# EasyEDA Pro project New Project_2026-09-05_09-11-29.eprj, schematic Schematic2
Board Name: 灯珠板; Create Date: 2026-09-05; Page Name: P1; Project Name: New Project_2026-09-05_09-11-29; Schematic Name: Schematic2; Update Date: 2026-09-06; Company: 嘉立创EDA; Page Size: A4; Version: V1.0
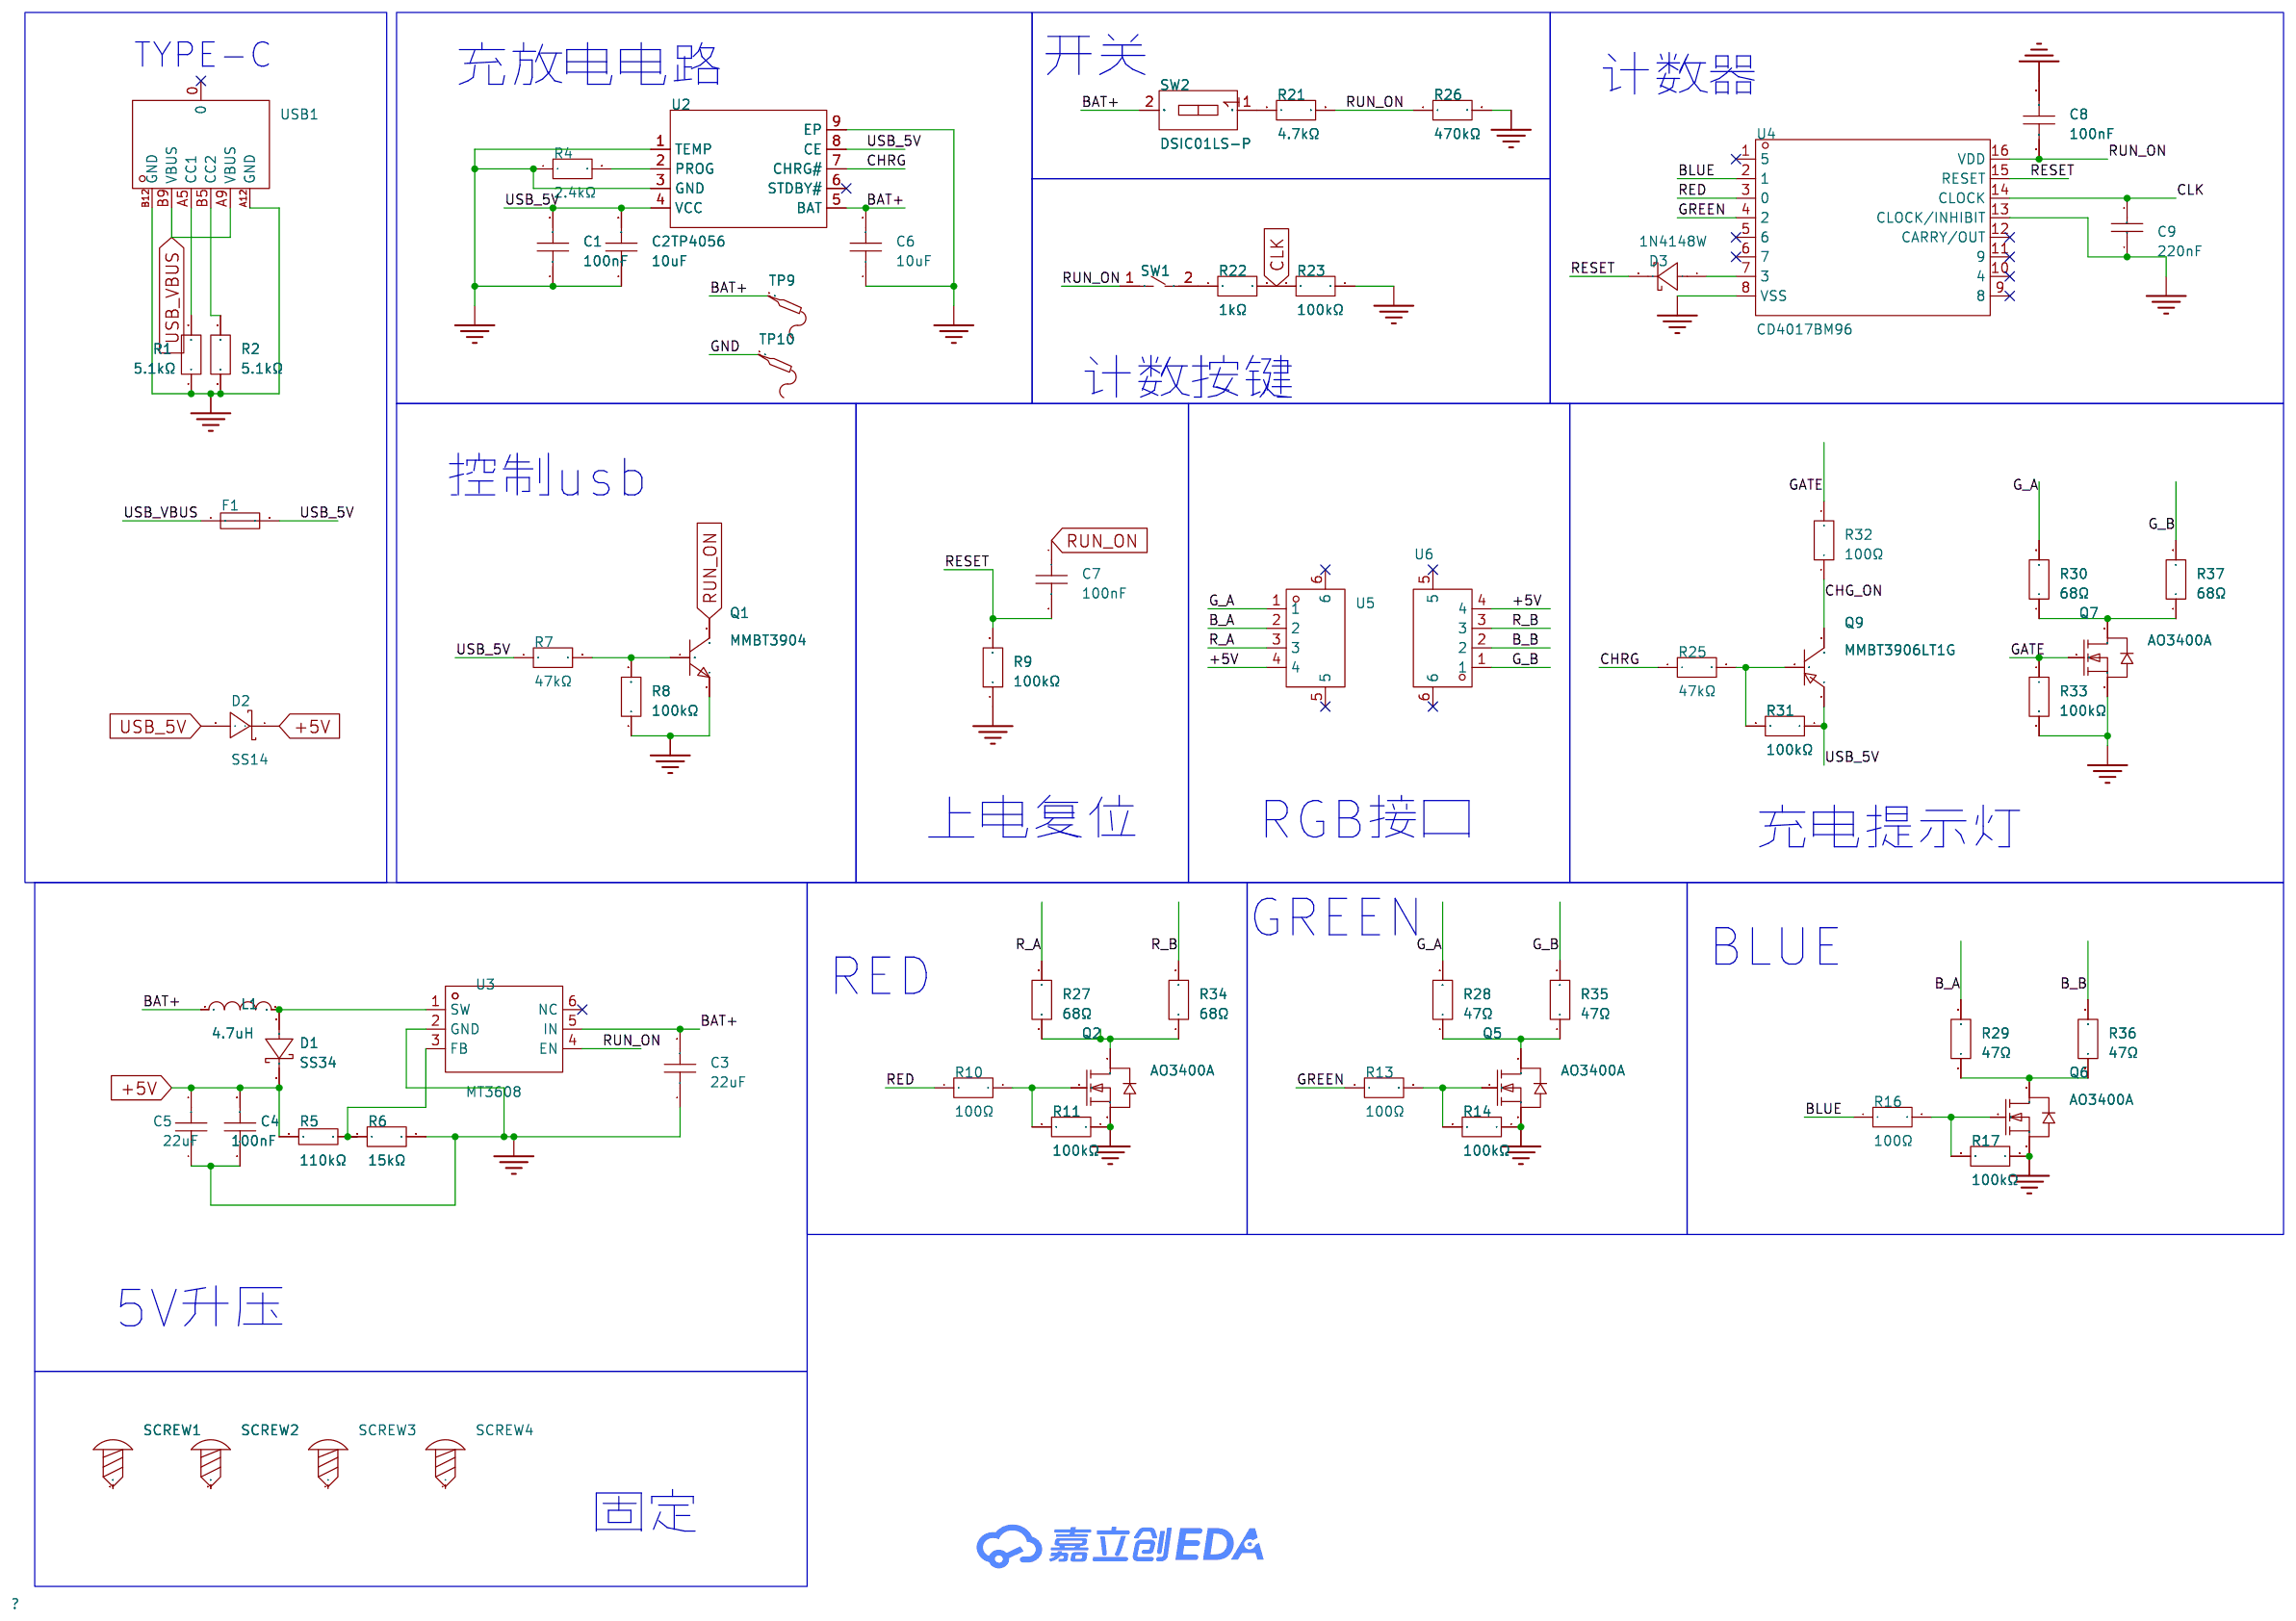
[diagram p0: schematic sheet]

## Parts
C1  100nF  [C0603]
C2  10uF  [C1206]
C3  22uF  [C0805]
C4  100nF  [C0603]
C5  22uF  [C0805]
C6  10uF  [C1206]
C7  100nF  [C0603]
C8  100nF  [C0603]
C9  220nF  [C0603]
D1  SS34  [SMA_L4.3-W2.6-LS5.0-FD]
D2  SS14  [SMA_L4.3-W2.6-LS5.2-RD]
D3  1N4148W  [SOD-123_L2.7-W1.6-LS3.7-FD]
F1  BSMD1206-200-6V  [F1206]
L1  4.7uH  [IND-SMD_L4.6-W4.1-A]
Q1  MMBT3904  [SOT-23-3_L2.9-W1.3-P1.90-LS2.4-BR]
Q2  AO3400A  [SOT-23-3_L2.9-W1.3-P1.90-LS2.4-BR]
Q5  AO3400A  [SOT-23-3_L2.9-W1.3-P1.90-LS2.4-BR]
Q6  AO3400A  [SOT-23-3_L2.9-W1.3-P1.90-LS2.4-BR]
Q7  AO3400A  [SOT-23-3_L2.9-W1.3-P1.90-LS2.4-BR]
Q9  MMBT3906LT1G  [SOT-23-3_L2.9-W1.3-P1.90-LS2.4-BR]
R1  5.1kΩ  [R0603]
R2  5.1kΩ  [R0603]
R4  2.4kΩ  [R0603]
R5  110kΩ  [R0603]
R6  15kΩ  [R0603]
R7  47kΩ  [R0603]
R8  100kΩ  [R0603]
R9  100kΩ  [R0603]
R10  100Ω  [R0603]
R11  100kΩ  [R0603]
R13  100Ω  [R0603]
R14  100kΩ  [R0603]
R16  100Ω  [R0603]
R17  100kΩ  [R0603]
R21  4.7kΩ  [R0603]
R22  1kΩ  [R0603]
R23  100kΩ  [R0603]
R25  47kΩ  [R0603]
R26  470kΩ  [R0603]
R27  68Ω  [R1210]
R28  47Ω  [R1210]
R29  47Ω  [R1210]
R30  68Ω  [R1210]
R31  100kΩ  [R0603]
R32  100Ω  [R0603]
R33  100kΩ  [R0603]
R34  68Ω  [R1210]
R35  47Ω  [R1210]
R36  47Ω  [R1210]
R37  68Ω  [R1210]
SCREW1  -  [M2螺丝]
SCREW2  -  [M2螺丝]
SCREW3  -  [M2螺丝]
SCREW4  -  [M2螺丝]
SW1  TSX06121-095B333DA-L2000  [SW-TH_L6.1-W6.1-P5.00]
SW2  DSIC01LS-P  [SW-SMD_2P-L3.5-W6.1-P2.54-LS9.8]
TP9  -  [Test-Point-0.5mm]
TP10  -  [Test-Point-0.5mm]
U2  TP4056  [ESOP-8_L4.9-W3.9-P1.27-LS6.0-BL-EP]
U3  MT3608  [SOT-23-6_L2.9-W1.6-P0.95-LS2.8-BL]
U4  CD4017BM96  [SOIC-16_L9.9-W3.9-P1.27-LS6.0-BL]
U5  WAFER-GH1.25-4PWB  [CONN-SMD_4P-P1.25_XUNPU_WAFER-GH1.25-4PWB]
U6  WAFER-GH1.25-4PWB  [CONN-SMD_4P-P1.25_XUNPU_WAFER-GH1.25-4PWB]
USB1  USB-TYPE-C-015  [USB-C-SMD_TYPE-C--015]

## Library data of the parts
C1 C4 C7 C8 = FCC0603B104K500CT: LCSC Part Name: 100nF ±10% 50V; Supplier Part: C5137636; Manufacturer: FOJAN(富捷); Supplier Footprint: 0603; JLCPCB Part Class: 扩展库; Datasheet: https://item.szlcsc.com/datasheet/FCC0603B104K500CT/5747088.html; Supplier: LCSC; Tolerance: ±10%; Voltage Rating: 50V; Temperature Coefficient: X7R; Operating Temperature: -55℃~+125℃
C2 C6 = HGC1206R5106K500NSPJ: LCSC Part Name: 10uF ±10% 50V; Supplier Part: C7432781; Manufacturer: Chinocera(华瓷); Supplier Footprint: 1206; JLCPCB Part Class: 扩展库; Datasheet: https://item.szlcsc.com/datasheet/HGC1206R5106K500NSPJ/8438263.html; Supplier: LCSC; Tolerance: ±10%; Voltage Rating: 50V; Temperature Coefficient: X5R
C3 C5 = CGA0805X5R226M250MT: LCSC Part Name: 22uF ±20% 25V; Supplier Part: C6119899; Manufacturer: HRE(芯声); Supplier Footprint: 0805; JLCPCB Part Class: 扩展库; Datasheet: https://item.szlcsc.com/datasheet/CGA0805X5R226M250MT/7062605.html; Supplier: LCSC; Tolerance: ±20%; Voltage Rating: 25V; Temperature Coefficient: X5R
C9 = CC0603KRX7R9BB224: LCSC Part Name: 220nF ±10% 50V; Supplier Part: C107083; Manufacturer: YAGEO(国巨); Supplier Footprint: 0603; JLCPCB Part Class: 扩展库; Datasheet: https://item.szlcsc.com/datasheet/CC0603KRX7R9BB224/108299.html; Supplier: LCSC; Tolerance: ±10%; Voltage Rating: 50V; Temperature Coefficient: X7R
D1 = SS34_C7420365: LCSC Part Name: 电压:40V 电流:3A; Supplier Part: C7420365; Manufacturer: R+O(宏嘉诚); Supplier Footprint: SMA(DO-214AC); JLCPCB Part Class: 扩展库; Datasheet: https://item.szlcsc.com/datasheet/SS34/8397187.html; Supplier: LCSC; Diode Configuration: 独立式; Voltage - Forward(Vf@If): 550mV@3A; Voltage - DC Reverse(Vr): 40V; Current - Rectified: 3A; Reverse Leakage Current (Ir): 200uA@40V
D2 = SS14_C83852: LCSC Part Name: 电压:40V 电流:1A; Supplier Part: C83852; Manufacturer: onsemi(安森美); Supplier Footprint: SMA(DO-214AC); JLCPCB Part Class: 扩展库; Datasheet: https://item.szlcsc.com/datasheet/SS14/85019.html; Supplier: LCSC; Voltage - Forward(Vf@If): 500mV@1A; Voltage - DC Reverse(Vr): 40V; Current - Rectified: 1A; Reverse Leakage Current (Ir): 200uA@40V; Operating Junction Temperature Range: -65℃~+125℃; Non-Repetitive Peak Forward Surge Current: 40A
D3 = 1N4148W_C7420318: LCSC Part Name: 100V 150mA; Supplier Part: C7420318; Manufacturer: R+O(宏嘉诚); Supplier Footprint: SOD-123; JLCPCB Part Class: 扩展库; Datasheet: https://item.szlcsc.com/datasheet/1N4148W/8397140.html; Supplier: LCSC; Diode Configuration: 独立式; Pd - Power Dissipation: 400mW; Current - Rectified: 150mA; Voltage - DC Reverse(Vr): 100V; Voltage - Forward(Vf@If): 1.25V@150mA; Non-Repetitive Peak Forward Surge Current: 2A; Reverse Leakage Current (Ir): 1uA@75V; Reverse Recovery Time (trr): 4ns; Operating Junction Temperature Range: -55℃~+150℃
F1 = BSMD1206-200-6V: LCSC Part Name: 6V 2A 1206自恢复; Supplier Part: C883134; Manufacturer: BHFUSE(佰宏); Supplier Footprint: 1206; JLCPCB Part Class: 扩展库; Datasheet: https://item.szlcsc.com/datasheet/BSMD1206-200-6V/947809.html; Supplier: LCSC; Voltage - Max: 6V; Current - Max: 100A; Hold Current: 2A; Trip Current: 3.5A; Power Dissipation: 1W; Resistance - Initial (Ri) (Min): 15mΩ; Resistance - Post Trip (R1) (Max): 80mΩ; Time to Trip(Max): 1.5s; Operating Temperature: -40℃~+85℃; Length: 3.6mm; Width: 1.9mm; Height: 1.6mm
L1 = SRG0420-4R7-M: LCSC Part Name: 高电流功率电感器，无卤素，金属粉末磁芯，磁屏蔽低电磁干扰，高载流低磁芯损耗，符合RoHS标准; Supplier Part: C53462918; Manufacturer: JIERR(捷而瑞); Supplier Footprint: SMD,4.6x4.1mm; JLCPCB Part Class: 扩展库; Datasheet: https://item.szlcsc.com/datasheet/SRG0420-4R7-M/56628163.html; Supplier: LCSC; Tolerance: ±20%; Current Rating: 3A; Current - Saturation(Isat): 3.5A; DC Resistance(DCR): 105mΩ; Type: 一体成型电感
Q1 = MMBT3904_C7420353: LCSC Part Name: hFE:100-300，丝印:1AM NPN 电流:200mA 电压:40V; Supplier Part: C7420353; Manufacturer: R+O(宏嘉诚); Supplier Footprint: SOT-23; JLCPCB Part Class: 扩展库; Datasheet: https://item.szlcsc.com/datasheet/MMBT3904/8397175.html; Supplier: LCSC; type: NPN; Current - Collector(Ic): 200mA; Collector - Emitter Voltage VCEO: 40V; Pd - Power Dissipation: 200mW; DC Current Gain: 100; Transition frequency(fT): 300MHz; Current - Collector Cutoff: 100nA; Vce Saturation(VCE(sat)): 300mV; Operating Temperature: -55℃~+150℃; Emitter-Base Voltage(Vebo): 6V; Number: 1个NPN; Configuration: 独立式
Q2 Q5-Q7 = AO3400A_C347475: LCSC Part Name: 1个N沟道 耐压:30V 电流:5.8A; Supplier Part: C347475; Manufacturer: UMW(友台半导体); Supplier Footprint: SOT-23; JLCPCB Part Class: 扩展库; Datasheet: https://item.szlcsc.com/datasheet/AO3400A/324135.html; Supplier: LCSC; Number: 1个N沟道; Drain to Source Voltage: 30V; Current - Continuous Drain(Id): 5.8A; RDS(on): 17mΩ@10V; Pd - Power Dissipation: 1.4W; Gate Threshold Voltage (Vgs(th)): 1.1V; Gate Charge(Qg): 9.7nC@4.5V; Input Capacitance(Ciss): 823pF; Reverse Transfer Capacitance (Crss@Vds): 77pF; Operating Temperature: -55℃~+150℃; Output Capacitance(Coss): 99pF
Q9 = MMBT3906LT1G: LCSC Part Name: PNP 电流:200mA 耐压:40V; Supplier Part: C53444; Manufacturer: onsemi(安森美); Supplier Footprint: SOT-23(TO-236); JLCPCB Part Class: 扩展库; Datasheet: https://atta.szlcsc.com/upload/public/pdf/source/20150713/1457707330085.pdf; Supplier: LCSC; Transistor Type: PNP; Collector Current (Ic): 200mA; Collector-Emitter Breakdown Voltage (Vceo): 40V; Power Dissipation (Pd): 225mW; DC Current Gain (hFE@Ic,Vce): 60@0.1mA,1.0V; Transition Frequency (fT): 250MHz; Collector Cut-Off Current (Icbo): 50nA; Collector-Emitter Saturation Voltage (VCE(sat)@Ic,Ib): 250mV@10mA,1.0mA; Operating Temperature: -55℃~+150℃
R1 R2 = FRC0603F5101TS: LCSC Part Name: 5.1kΩ ±1% 100mW 厚膜电阻; Supplier Part: C2907044; Manufacturer: FOJAN(富捷); Supplier Footprint: 0603; JLCPCB Part Class: 扩展库; Supplier: LCSC; Type: 厚膜电阻; Tolerance: ±1%; Power(Watts): 100mW; Voltage-Supply(Max): 75V; Temperature Coefficient: ±100ppm/℃; Operating Temperature: -55℃~+155℃
R4 = FRC0603F2401TS: LCSC Part Name: 2.4kΩ ±1% 100mW 厚膜电阻; Supplier Part: C2907007; Manufacturer: FOJAN(富捷); Supplier Footprint: 0603; JLCPCB Part Class: 扩展库; Supplier: LCSC; Type: 厚膜电阻; Tolerance: ±1%; Power(Watts): 100mW; Voltage-Supply(Max): 75V; Temperature Coefficient: ±100ppm/℃; Operating Temperature: -55℃~+155℃
R5 = 0603WAF1103T5E: LCSC Part Name: 厚膜电阻 110kΩ ±1%; Supplier Part: C25805; Manufacturer: UNI-ROYAL(厚声); Supplier Footprint: 0603; JLCPCB Part Class: 扩展库; Datasheet: https://item.szlcsc.com/datasheet/0603WAF1103T5E/26548.html; Supplier: LCSC; Type: 厚膜电阻; Tolerance: ±1%; Power(Watts): 100mW; Voltage-Supply(Max): 75V; Temperature Coefficient: ±100ppm/℃; Operating Temperature: -55℃~+155℃
R6 = FRC0603F1502TS: LCSC Part Name: 15kΩ ±1% 100mW 厚膜电阻; Supplier Part: C2906995; Manufacturer: FOJAN(富捷); Supplier Footprint: 0603; JLCPCB Part Class: 扩展库; Supplier: LCSC; Type: 厚膜电阻; Tolerance: ±1%; Power(Watts): 100mW; Voltage-Supply(Max): 75V; Temperature Coefficient: ±100ppm/℃; Operating Temperature: -55℃~+155℃
R7 R25 = FRC0603F4702TS: LCSC Part Name: 47kΩ ±1% 100mW 厚膜电阻; Supplier Part: C2907042; Manufacturer: FOJAN(富捷); Supplier Footprint: 0603; JLCPCB Part Class: 扩展库; Supplier: LCSC; Type: 厚膜电阻; Tolerance: ±1%; Power(Watts): 100mW; Voltage-Supply(Max): 75V; Temperature Coefficient: ±100ppm/℃; Operating Temperature: -55℃~+155℃
R8 R9 R11 R14 R17 R23 R31 R33 = FRC0603F1003TS: LCSC Part Name: 100kΩ ±1% 100mW 厚膜电阻; Supplier Part: C2906980; Manufacturer: FOJAN(富捷); Supplier Footprint: 0603; Datasheet: https://item.szlcsc.com/datasheet/FRC0603F1003TS/3180493.html; Supplier: LCSC; Type: 厚膜电阻; Tolerance: ±1%; Power(Watts): 100mW; Voltage-Supply(Max): 75V; Temperature Coefficient: ±100ppm/℃; Operating Temperature: -55℃~+155℃
R10 R13 R16 R32 = FRC0603F1000TS: LCSC Part Name: 100Ω ±1% 100mW 厚膜电阻; Supplier Part: C2906981; Manufacturer: FOJAN(富捷); Supplier Footprint: 0603; JLCPCB Part Class: 扩展库; Datasheet: https://item.szlcsc.com/datasheet/FRC0603F1000TS/3180494.html; Supplier: LCSC; Type: 厚膜电阻; Tolerance: ±1%; Power(Watts): 100mW; Voltage-Supply(Max): 75V; Temperature Coefficient: ±100ppm/℃; Operating Temperature: -55℃~+155℃
R21 = FRC0603F4701TS: LCSC Part Name: 4.7kΩ ±1% 100mW 厚膜电阻; Supplier Part: C2907034; Manufacturer: FOJAN(富捷); Supplier Footprint: 0603; JLCPCB Part Class: 扩展库; Datasheet: https://item.szlcsc.com/datasheet/FRC0603F4701TS/3180547.html; Supplier: LCSC; Type: 厚膜电阻; Tolerance: ±1%; Power(Watts): 100mW; Voltage-Supply(Max): 75V; Temperature Coefficient: ±100ppm/℃; Operating Temperature: -55℃~+155℃
R22 = PTFR0603B1K00N9: LCSC Part Name: 薄膜电阻 1kΩ ±0.1% 100mW; Supplier Part: C394536; Manufacturer: RESI(开步睿思); Supplier Footprint: 0603; JLCPCB Part Class: 扩展库; Datasheet: https://item.szlcsc.com/datasheet/PTFR0603B1K00N9/373961.html; Supplier: LCSC; Type: 薄膜电阻; Tolerance: ±0.1%; Power(Watts): 100mW; Voltage-Supply(Max): 100V; Temperature Coefficient: ±10ppm/℃; Operating Temperature: -55℃~+125℃
R26 = FRC0603F4703TS: LCSC Part Name: 470kΩ ±1% 100mW 厚膜电阻; Supplier Part: C2907040; Manufacturer: FOJAN(富捷); Supplier Footprint: 0603; JLCPCB Part Class: 扩展库; Datasheet: https://item.szlcsc.com/datasheet/FRC0603F4703TS/3180553.html; Supplier: LCSC; Type: 厚膜电阻; Tolerance: ±1%; Power(Watts): 100mW; Voltage-Supply(Max): 75V; Temperature Coefficient: ±100ppm/℃; Operating Temperature: -55℃~+155℃
R27 R30 R34 R37 = FRC1210J680TS: LCSC Part Name: 厚膜电阻 68Ω ±5% 500mW; Supplier Part: C2930448; Manufacturer: FOJAN(富捷); Supplier Footprint: 1210; JLCPCB Part Class: 扩展库; Supplier: LCSC; Type: 厚膜电阻; Tolerance: ±5%; Power(Watts): 500mW; Voltage-Supply(Max): 200V; Temperature Coefficient: ±100ppm/℃; Operating Temperature: -55℃~+155℃
R28 R29 R35 R36 = FRC1210F43R0TS: LCSC Part Name: 厚膜电阻 43Ω ±1% 500mW; Supplier Part: C2999573; Manufacturer: FOJAN(富捷); Supplier Footprint: 1210; JLCPCB Part Class: 扩展库; Datasheet: https://item.szlcsc.com/datasheet/FRC1210F43R0TS/3477013.html; Supplier: LCSC; Type: 厚膜电阻; Tolerance: ±1%; Power(Watts): 500mW; Voltage-Supply(Max): 200V; Temperature Coefficient: ±100ppm/℃; Operating Temperature: -55℃~+155℃
SCREW1-SCREW4 = M2螺丝: Supplier Footprint: 插件
SW1 = TSX06121-095B333DA-L2000: LCSC Part Name: 6*6*9.5长两脚防水轻触开关; Supplier Part: C42435357; Manufacturer: Khon(康宏电子); Supplier Footprint: 插件,6.1x6.1mm; Datasheet: https://item.szlcsc.com/datasheet/TSX06121-095B333DA-L2000/44473186.html; Supplier: LCSC; Circuit: 单刀单掷; Actuator Style: 圆形按钮; Operating Force: 1.8N; Length: 6.1mm; Width: 6.1mm; Switch Height: 9.5mm; with Bracket: 不带支架; Contact Current: 50mA; Voltage Rating: 12V; Actuator/Cap Color: 黑色; With Lamp: 无; Life: 10万次; Operating Temperature: -40℃~85℃
SW2 = DSIC01LS-P: LCSC Part Name: 平拨,凸起式 1位拨码开关; Supplier Part: C600988; Manufacturer: XKB Connection(中国星坤); Supplier Footprint: SMD; JLCPCB Part Class: 扩展库; Datasheet: https://item.szlcsc.com/datasheet/DSIC01LS-P/631008.html; Supplier: LCSC; Type: 平拨,凸起式; Circuit: 单刀单掷; Number of Positions: 1位; Termination Style: 鸥翼型; Current Rating: 25mA; Voltage Rating: 24V; Operating Temperature: -20℃~+70℃; Operating Life: 3千次; Color: 黑色
TP9 TP10 = Test-Point
U2 = TP4056_C725790: LCSC Part Name: 1A独立式线性锂离子电池充电器; Supplier Part: C725790; Manufacturer: UMW(友台半导体); Supplier Footprint: ESOP-8; JLCPCB Part Class: 扩展库; Datasheet: https://item.szlcsc.com/datasheet/TP4056/772193.html; Supplier: LCSC; The Chip Type: 充电芯片; Voltage - Supply: 4V~6.5V; Charge Current - Max: 1A; Charging Saturation Voltage: 4.2V; Type of Battery: 锂电池; Number of Cells: 1; Operating Temperature: -40℃~+85℃; Battery Temperature Detection: 支持; 0V Battery Charge: 支持; Supply Current (Iq): 35uA; Features: 恒压充电；恒流充电；自动再充电；充电终止；软启动；可编程充电电流；欠压锁定；涓流充电
U3 = MT3608: LCSC Part Name: 老版本 升压型 2A 2V~24V; Supplier Part: C84817; Manufacturer: 西安航天民芯; Supplier Footprint: SOT-23-6; JLCPCB Part Class: 扩展库; Datasheet: https://item.szlcsc.com/datasheet/MT3608/85988.html; Supplier: LCSC; Function: 升压型; Voltage - Supply: 2V~24V; Output Voltage: 600mV~28V; Output Current: 2A; Frequency - Switching: 1.2MHz; Operating Temperature: -40℃~+85℃; Synchronous Rectifier: 否; Number of Outputs: 1; Topology: 升压式; Quiescent Current: 100uA；1.6mA; Switch tube (built-in/external): 内置; Output Type: 可调; Features: 轻载高效模式；过流保护
U4 = CD4017BM96: LCSC Part Name: CMOS计数器/分频器 高压类型; Supplier Part: C11349; Manufacturer: TI(德州仪器); Supplier Footprint: SOIC-16; JLCPCB Part Class: 扩展库; Datasheet: https://www.ti.com/cn/lit/ds/symlink/cd4017b.pdf; Supplier: LCSC; Logic Type: 10分频; Series: CD4000; Direction: 向上计数器; Voltage - Supply: 3V~18V; Number of Elements: 1; Trigger Type: 上升沿; Reset: 异步; Count Rate: 5.5MHz; Propagation Delay: 135ns; Power Dissipation: 500mW; Operating Temperature: -55℃~+125℃; Features: 复位功能；级联计数器；静态运行
U5 U6 = WAFER-GH1.25-4PWB: LCSC Part Name: 1x4P 间距:1.25mm 卧贴 系列:GH; Supplier Part: C3029379; Manufacturer: XUNPU(讯普); Supplier Footprint: SMD,P=1.25mm,卧贴; JLCPCB Part Class: 扩展库; Datasheet: https://item.szlcsc.com/datasheet/WAFER-GH1.25-4PWB/3561391.html; Supplier: LCSC; Pins Structure: 1x4P; Pitch: 1.25mm; Mounting Type: 卧贴; Reference Series: GH; Number of Pins: 4P; Number of Rows: 1; Number of PINs Per Row: 4; Current Rating: 1A; Contact Material: 黄铜; Contact Plating: 锡; Operating Temperature: -25℃~+85℃; Voltage Rating: 125V; Plastic Material: LCP; Supplementary Features: 辅助焊脚; Color: 米色; Z-Height of the Board: 4.35mm; X-Length of Bottom Edge on Board (Spacing Line): 8.25mm; Y-Width of Bottom Edge on Board: 5mm
USB1 = USB-TYPE-C-015: LCSC Part Name: Type-C 母 立贴; Supplier Part: C2927035; Manufacturer: DEALON(德艺隆); Supplier Footprint: SMD; JLCPCB Part Class: 扩展库; Datasheet: https://item.szlcsc.com/datasheet/USB-TYPE-C-015/3252504.html; Supplier: LCSC; Connector Type: Type-C; Gender: 母; Mounting Type: 立贴; Number of Contacts: 6P; Number of Ports: 1; Current Rating-Power: 3A; Voltage Rating: 5V; Connect-Disconnect Life: 5千次; Length: 6.8mm; Operating Temperature: -25℃~+85℃

## Nets
+5V: C4.2 C5.2 D1.2(K) D2.1(K) R5.2 U5.4 U6.4
GND: C1.1 C2.1 C3.1 C4.1 C5.1 C6.1 C8.2 C9.1 Q1.2(E) Q2.2(S) Q5.2(S) Q6.2(S) Q7.2(S) R1.1 R2.1 R4.1 R6.1 R8.1 R9.1 R11.1 R14.1 R17.1 R23.1 R26.2 R33.2 TP10.1 U2.1(TEMP) U2.3(GND) U2.9(EP) U3.2(GND) U4.8(VSS) U4.13(CLOCK/INHIBIT) USB1.A12(GND) USB1.B12(GND)
B_A: R29.2 U5.2
B_B: R36.2 U6.2
BAT+: C3.2 C6.2 L1.1 SW2.2(PIN2) TP9.1 U2.5(BAT) U3.5(IN)
BLUE: R16.1 U4.2(1)
CHG_ON: Q9.3(C) R32.1
CHRG: R25.1 U2.7(CHRG#)
CLK: C9.2 R22.2 R23.2 U4.14(CLOCK)
G_A: R28.2 R30.2 U5.1
G_B: R35.2 R37.2 U6.1
GATE: Q7.1(G) R32.2 R33.1
GREEN: R13.1 U4.4(2)
R_A: R27.2 U5.3
R_B: R34.2 U6.3
RED: R10.1 U4.3(0)
RESET: C7.2 D3.2(K) R9.2 U4.15(RESET)
RUN_ON: C7.1 C8.1 Q1.3(C) R21.2 R26.1 SW1.1 U3.4(EN) U4.16(VDD)
USB_5V: C1.2 C2.2 D2.2(A) F1.2 Q9.2(E) R7.1 R31.1 U2.4(VCC) U2.8(CE)
USB_VBUS: F1.1 USB1.A9(VBUS) USB1.B9(VBUS)
Net-(D1-1): D1.1(A) L1.2 U3.1(SW)
Net-(D3-1): D3.1(A) U4.7(3)
Net-(Q1-1): Q1.1(B) R7.2 R8.2
Net-(Q2-1): Q2.1(G) R10.2 R11.2
Net-(Q2-3): Q2.3(D) R27.1 R34.1
Net-(Q5-1): Q5.1(G) R13.2 R14.2
Net-(Q5-3): Q5.3(D) R28.1 R35.1
Net-(Q6-1): Q6.1(G) R16.2 R17.2
Net-(Q6-3): Q6.3(D) R29.1 R36.1
Net-(Q7-3): Q7.3(D) R30.1 R37.1
Net-(Q9-1): Q9.1(B) R25.2 R31.2
Net-(R1-2): R1.2 USB1.A5(CC1)
Net-(R2-2): R2.2 USB1.B5(CC2)
Net-(R4-2): R4.2 U2.2(PROG)
Net-(R5-1): R5.1 R6.2 U3.3(FB)
Net-(R21-1): R21.1 SW2.1(PIN1)
Net-(R22-1): R22.1 SW1.2

Not connected (* = marked no-connect by the designer): SCREW1 1; SCREW2 1; SCREW3 1; SCREW4 1; U2 6(STDBY#)*; U3 6(NC)*; U4 1(5)* 5(6)* 6(7)* 9(8)* 10(4)* 11(9)* 12(CARRY/OUT)*; U5 5* 6*; U6 5* 6*; USB1 0*

## Notes on the sheet
- TYPE-C
- 充放电电路
- 开关
- 计数器
- 计数按键
- 控制usb
- 上电复位
- RGB接口
- 充电提示灯
- GREEN
- BLUE
- RED
- 5V升压
- 固定
